# Altium schematic sheet input.SchDoc
size A4
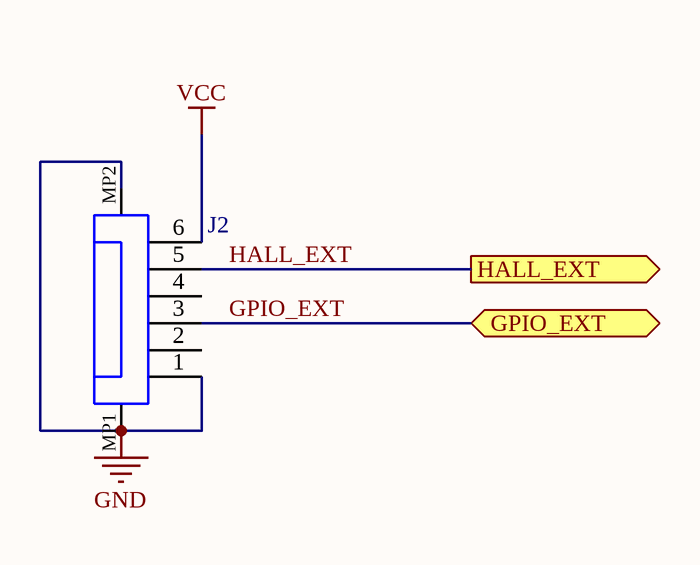
[diagram p0: input.SchDoc]

## Parts
J2  68610614422  [68610614422]  (value not drawn)

## Ports
GPIO_EXT (bidir), HALL_EXT (out)

## Nets
GND: J2.1 J2.MP1 J2.MP2
VCC: J2.6
GPIO_EXT: J2.3 ; port GPIO_EXT
HALL_EXT: J2.5 ; port HALL_EXT

Not connected (* = marked no-connect by the designer): J2 2 4

## Library data of the parts
J2 = CMP-1502-01454-1: SMT ZIF Connectors WR-FPC, Horizontal, Bottom Contact, pitch 1 mm, 6 pins; Manufacturer: Wurth Elektronik; Contact Resistance: 20mOhm; Rated Current: 1A; Pitch: 1mm; Withstanding Voltage: 500VAC; Working Voltage: 125VAC; Pin Number: 6; Operating Temperature: -25to85degC; Packaging: TapeandReel; Contact Design: BottomContact; Manufacturer URL: http://www.we-online.de; Part Number: 68610614422; Publisher: WurthElektronik; Package Reference: 68610614422; Datasheet URL: https://katalog.we-online.de/em/datasheet/68610614422.pdf; Mounting Technology: SMT; Orientation: Horizontal; System: Connector